# Altium schematic sheet mcu.SchDoc
size A4
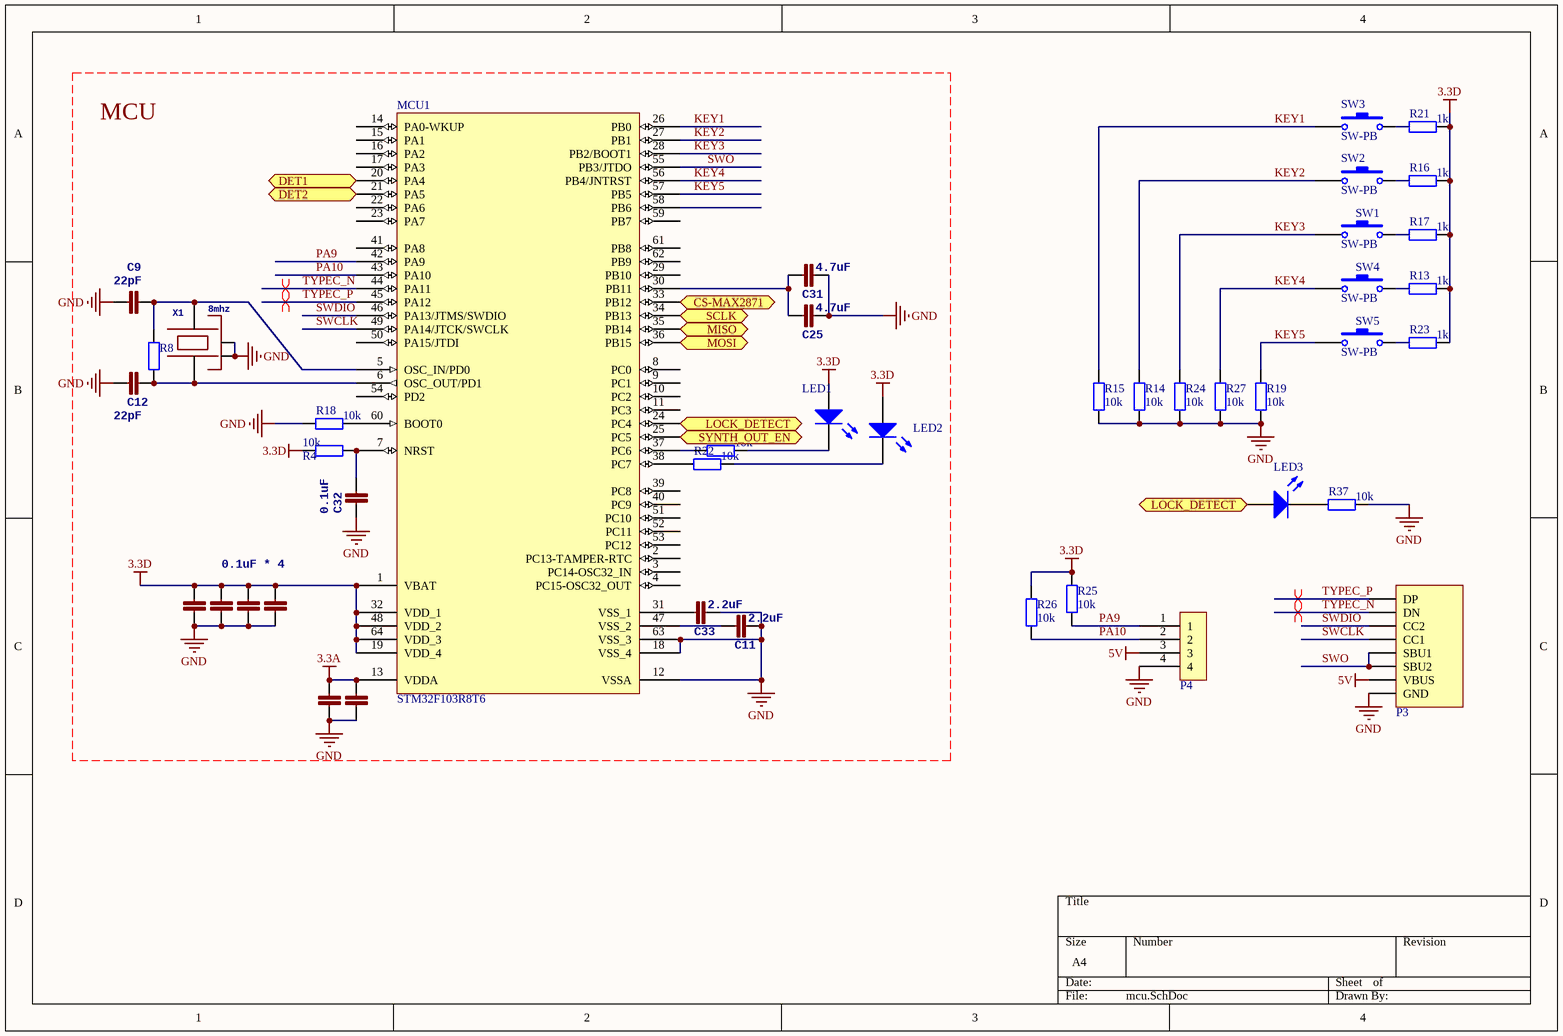
[diagram p0: mcu.SchDoc]

## Parts
C3  1n  [0402]  (value not drawn)
C4  0.1uF * 4  [0402]
C5  1n  [0402]  (value not drawn)
C6  1n  [0402]  (value not drawn)
C7  1n  [0402]  (value not drawn)
C8  1n  [0402]  (value not drawn)
C9  22pF  [0402]
C11  2.2uF  [0603]
C12  22pF  [0402]
C25  4.7uF  [0603]
C31  4.7uF  [0603]
C32  0.1uF  [0402]
C33  2.2uF  [0603]
LED1  LED0  [0603]  (value not drawn)
LED2  LED0  [0603]  (value not drawn)
LED3  LED0  [0603]  (value not drawn)
MCU1  STM32F103R8T6  [LQFP64_N]
P3  USBC  [USBTC]  (value not drawn)
P4  UART/I2C  [4pSocket]  (value not drawn)
R4  10k  [0402]
R8  (no value)  [0402]
R13  1k  [0402]
R14  10k  [0402]
R15  10k  [0402]
R16  1k  [0402]
R17  1k  [0402]
R18  10k  [0402]
R19  10k  [0402]
R20  10k  [0402]
R21  1k  [0402]
R22  10k  [0402]
R23  1k  [0402]
R24  10k  [0402]
R25  10k  [0402]
R26  10k  [0402]
R27  10k  [0402]
R37  10k  [0402]
SW1  SW-PB  [SW3x4]
SW2  SW-PB  [SW3x4]
SW3  SW-PB  [SW3x4]
SW4  SW-PB  [SW3x4]
SW5  SW-PB  [SW3x4]
X1  8mhz  [OSCILLATOR-3.2X2.5]

## Ports
CS-MAX2871 (out), DET1, DET2, LOCK_DETECT, MISO, MOSI, SCLK (out), SYNTH_OUT_EN

## Nets
3.3A: C3.1 C8.1 MCU1.13(VDDA)
3.3D: C4.2 C5.2 C6.2 C7.2 LED1.1(A) LED2.1(A) MCU1.1(VBAT) MCU1.19(VDD_4) MCU1.32(VDD_1) MCU1.48(VDD_2) MCU1.64(VDD_3) R4.2 R13.2 R16.2 R17.2 R21.2 R23.2 R25.2 R26.2
5V: P3.VBUS P4.3
GND: C3.2 C4.1 C5.1 C6.1 C7.1 C8.2 C9.2 C11.2 C12.2 C25.2 C31.2 C32.1 C33.2 MCU1.12(VSSA) MCU1.18(VSS_4) MCU1.63(VSS_3) P3.GND P4.4 R14.1 R15.1 R18.1 R19.1 R24.1 R27.1 R37.2 X1.2(NC_2) X1.4(NC_4)
CS-MAX2871: MCU1.33(PB12) ; port CS-MAX2871
DET1: MCU1.20(PA4) ; port DET1
DET2: MCU1.21(PA5) ; port DET2
KEY1: MCU1.26(PB0) R15.2 SW3.1
KEY2: MCU1.27(PB1) R14.2 SW2.1
KEY3: MCU1.28(PB2/BOOT1) R24.2 SW1.1
KEY4: MCU1.56(PB4/JNTRST) R27.2 SW4.1
KEY5: MCU1.57(PB5) R19.2 SW5.1
LOCK_DETECT: LED3.1(A) MCU1.24(PC4) ; port LOCK_DETECT
MISO: MCU1.35(PB14) ; port MISO
MOSI: MCU1.36(PB15) ; port MOSI
PA9: MCU1.42(PA9) P4.1 R25.1
PA10: MCU1.43(PA10) P4.2 R26.1
SCLK: MCU1.34(PB13) ; port SCLK
SWCLK: MCU1.49(PA14/JTCK/SWCLK) P3.CC1
SWDIO: MCU1.46(PA13/JTMS/SWDIO) P3.CC2
SWO: MCU1.55(PB3/JTDO) P3.SBU1 P3.SBU2
SYNTH_OUT_EN: MCU1.25(PC5) ; port SYNTH_OUT_EN
TYPEC_N: MCU1.44(PA11) P3.DN
TYPEC_P: MCU1.45(PA12) P3.DP
NetC9_1: C9.1 MCU1.5(OSC_IN/PD0) R8.2 X1.3
NetC11_1: C11.1 MCU1.47(VSS_2)
NetC12_1: C12.1 MCU1.6(OSC_OUT/PD1) R8.1 X1.1
NetC25_1: C25.1 C31.1 MCU1.30(PB11)
NetC32_2: C32.2 MCU1.7(NRST) R4.1
NetC33_1: C33.1 MCU1.31(VSS_1)
NetLED1_2: LED1.2(K) R20.2
NetLED2_2: LED2.2(K) R22.2
NetLED3_2: LED3.2(K) R37.1
NetMCU1_37: MCU1.37(PC6) R20.1
NetMCU1_38: MCU1.38(PC7) R22.1
NetMCU1_60: MCU1.60(BOOT0) R18.2
NetR13_1: R13.1 SW4.2
NetR16_1: R16.1 SW2.2
NetR17_1: R17.1 SW1.2
NetR21_1: R21.1 SW3.2
NetR23_1: R23.1 SW5.2

Not connected (* = marked no-connect by the designer): MCU1 2(PC13-TAMPER-RTC) 3(PC14-OSC32_IN) 4(PC15-OSC32_OUT) 8(PC0) 9(PC1) 10(PC2) 11(PC3) 14(PA0-WKUP) 15(PA1) 16(PA2) 17(PA3) 22(PA6) 23(PA7) 29(PB10) 39(PC8) 40(PC9) 41(PA8) 50(PA15/JTDI) 51(PC10) 52(PC11) 53(PC12) 54(PD2) 58(PB6) 59(PB7) 61(PB8) 62(PB9)

## Layout directives
differential pair: TYPEC_N, TYPEC_P

## Notes on the sheet
- MCU

## Library data of the parts
C3-C9 C11 C12 C25 C31-C33 = CAP0402-CAP: <b>Capacitor</b> / Standard 0603 ceramic capacitor, and 0.1" leaded capacitor.; PARTNO: CC0402ZRY5V7BB104
LED1-LED3 = LED0: Typical INFRARED GaAs LED; Published: 8-Jun-2000; LatestRevisionDate: 08-Jul-2005; LatestRevisionNote: Mech Layer 1 removed.; PackageReference: LED-0; Publisher: Altium Limited; PackageDescription: LED; 2 Leads
MCU1 = STM32F103R8T6: STM32 ARM-based 32-bit MCU with 64 Kbytes Flash, 64-pin LQFP, Industrial Temperature; Published: *; DatasheetVersion: *; PackageVersion: *; PackageReference: *; Publisher: *; PackageDescription: *; ComponentLink1Description: *; ComponentLink1URL: *; ComponentLink2Description: *; ComponentLink2URL: *
P4 = 4PSocket
R4 R8 R13-R27 R37 = Res2: Resistor; Value: 0Ohm; Published: 8-Jun-2000; LatestRevisionDate: 17-Jul-2002; LatestRevisionNote: Re-released for DXP Platform.; PackageReference: AXIAL-0.4; Publisher: Altium Limited; PackageDescription: Axial Device, Thru-Hole; 2 Leads; 0.4 in Pin Spacing
SW1-SW5 = SW-PB: Switch; Published: 24-Mar-1999; LatestRevisionDate: 17-Jul-2002; LatestRevisionNote: Re-released for DXP Platform.; PackageReference: SPST-2; Publisher: Altium Limited; PackageDescription: Switch; 2 Leads
X1 = OSCILLATOR-3.2X2.5: Crystal Oscillator in 3.2x2.5 SMD